# EAGLE design EPD_DRIVER (EAGLE 7.2.0)
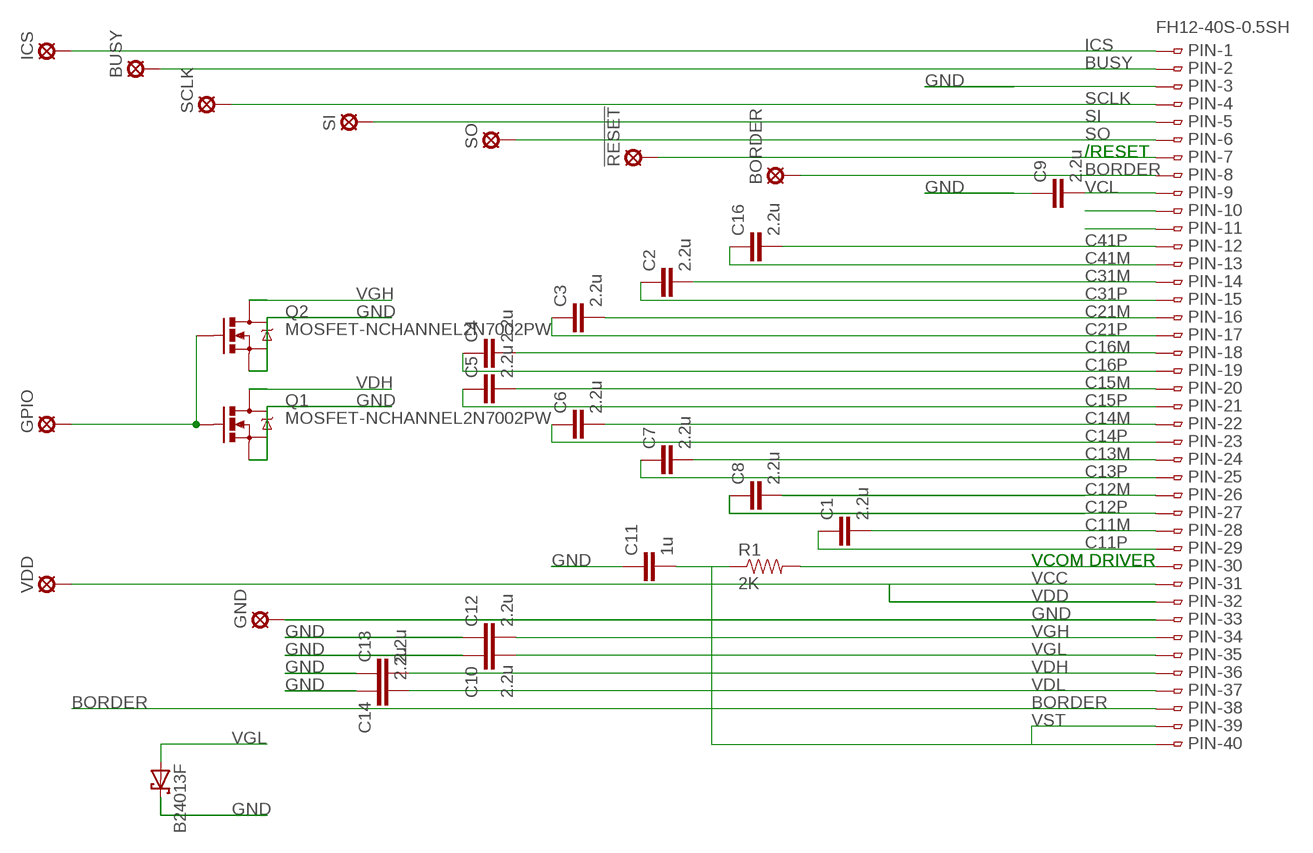
[diagram p0: schematic, sheet 1]

## Parts
!RESET  SE11  [SE11]
B24013F  SCHOTTKY-DIODESMD  [SMB]
BORDER  SE11  [SE11]
BUSY  SE11  [SE11]
C1  2.2u  CAP0603-CAP  [0603-CAP]
C2  2.2u  CAP0603-CAP  [0603-CAP]
C3  2.2u  CAP0603-CAP  [0603-CAP]
C4  2.2u  CAP0603-CAP  [0603-CAP]
C5  2.2u  CAP0603-CAP  [0603-CAP]
C6  2.2u  CAP0603-CAP  [0603-CAP]
C7  2.2u  CAP0603-CAP  [0603-CAP]
C8  2.2u  CAP0603-CAP  [0603-CAP]
C9  2.2u  CAP0603-CAP  [0603-CAP]
C10  2.2u  CAP0603-CAP  [0603-CAP]
C11  1u  CAP0603-CAP  [0603-CAP]
C12  2.2u  CAP0603-CAP  [0603-CAP]
C13  2.2u  CAP0603-CAP  [0603-CAP]
C14  2.2u  CAP0603-CAP  [0603-CAP]
C16  2.2u  CAP0603-CAP  [0603-CAP]
GND  SE11  [SE11]
GPIO  SE11  [SE11]
ICS  SE11  [SE11]
PIN  FH12-40S-0.5SH  [FH12-40S-0.5SH]
Q1  MOSFET-NCHANNEL2N7002PW  [SOT323]
Q2  MOSFET-NCHANNEL2N7002PW  [SOT323]
R1  2K  RESISTOR0603-RES  [0603-RES]
SCLK  SE11  [SE11]
SI  SE11  [SE11]
SO  SE11  [SE11]
VDD  SE11  [SE11]

## Nets
BORDER: BORDER.MP PIN.8 PIN.38
GND: B24013F.C C9.1 C10.1 C11.1 C12.1 C13.1 C14.1 PIN.3 Q1.2(S) Q2.2(S)
ICS: ICS.MP PIN.1
N$1: PIN.4 SCLK.MP
N$2: BUSY.MP PIN.2
N$4: PIN.5 SI.MP
N$5: PIN.6 SO.MP
N$6: !RESET.MP PIN.7
N$8: GND.MP PIN.33
N$9: PIN.10
N$10: PIN.11
N$11: C16.2 PIN.12
N$12: C16.1 PIN.13
N$13: C2.2 PIN.14
N$14: C2.1 PIN.15
N$15: C3.2 PIN.16
N$16: C3.1 PIN.17
N$17: C4.2 PIN.18
N$18: C4.1 PIN.19
N$19: C5.2 PIN.20
N$20: C5.1 PIN.21
N$21: C6.2 PIN.22
N$22: C6.1 PIN.23
N$23: C7.2 PIN.24
N$24: C7.1 PIN.25
N$25: C8.2 PIN.26
N$26: C8.1 PIN.27
N$27: C1.2 PIN.28
N$28: C1.1 PIN.29
N$29: PIN.30 R1.2
N$30: PIN.31 PIN.32 VDD.MP
N$41: GPIO.MP Q1.1(G) Q2.1(G)
VCL: C9.2 PIN.9
VDH: C13.2 PIN.36 Q1.3(D)
VDL: C14.2 PIN.37
VGH: C10.2 PIN.34 Q2.3(D)
VGL: B24013F.A C12.2 PIN.35
VST: C11.2 PIN.39 PIN.40 R1.1

## Notes on the sheet
- ICS
- BUSY
- SCLK
- SI
- SO
- /RESET | /RESET
- BORDER
- VCL
- C41P
- C41M
- C31M
- C31P
- C21M
- C21P
- C16M
- C16P
- C15M
- C15P
- C14M
- C14P
- C13M
- C13P
- C12M
- C12P
- C11M
- C11P
- VCOM DRIVER | VCOM DRIVER
- VCC
- VDD
- GND
- VGL
- VDH
- VDL
- BORDER
- VST
- VGL

## Library data of the parts
!RESET BORDER BUSY GND GPIO ICS SCLK SI SO VDD = solpad:SE11: SOLDER PAD RTM, drill 1,1mm, distributor Buerklin, 07F810
B24013F = diode:SCHOTTKY-DIODE: Schottky Diode
C1-C14 C16 = SparkFun-Capacitors:CAP: Capacitor Standard 0603 ceramic capacitor, and 0.1" leaded capacitor.
PIN = con-hirose:FH12-40S-0.5S: 0.5mm Pitch Connectors For FPC/FFC Source: Data sheet <http://www.hirose.co.jp/cataloge_hp/e58605370.pdf>; MPN: FH12-40S-0.5SH(55); OC_FARNELL: 1324556; OC_NEWARK: 34M6178
Q1 Q2 = SparkFun-DiscreteSemi:MOSFET-NCHANNEL: Common NMOSFET Parts MFG P/N Store ID Prod ID FDD8780 TRANS-09984 SI7820DN TRANS-11055 FDS6630A IC-08089 2N7002PW TRANS-11151 FQP30N06L COM-10213 TRANS-10060 BSS123LT1G TRANS-08345 BSS138 TRANS-00830 BS170 2N7000; PROD_ID: TRANS-11151
R1 = SparkFun-Passives:RESISTOR: Resistor Basic schematic elements and footprints for 0603, 1206, and PTH resistors.

## Board
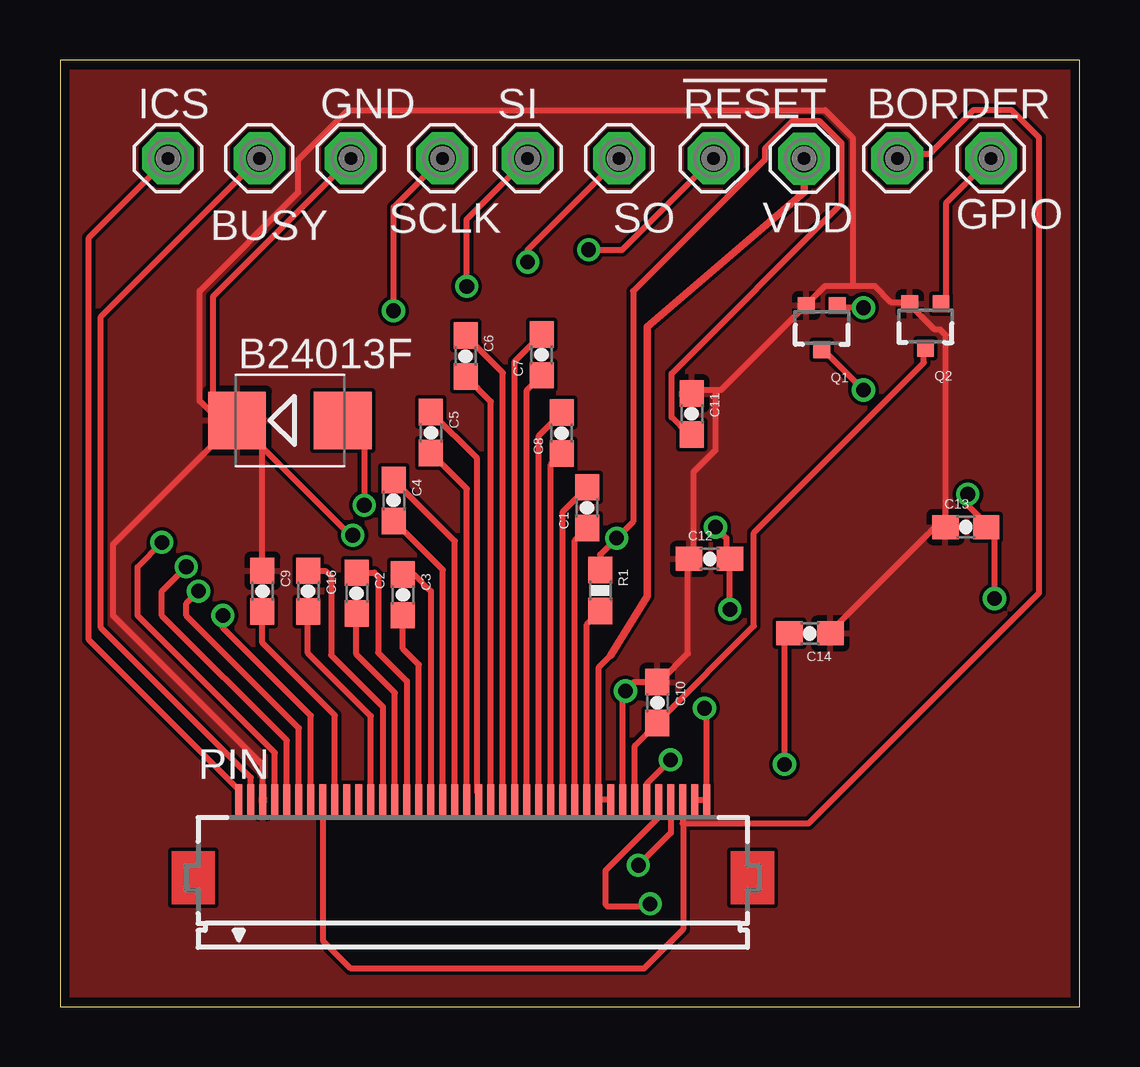
[diagram p1: board, top side]
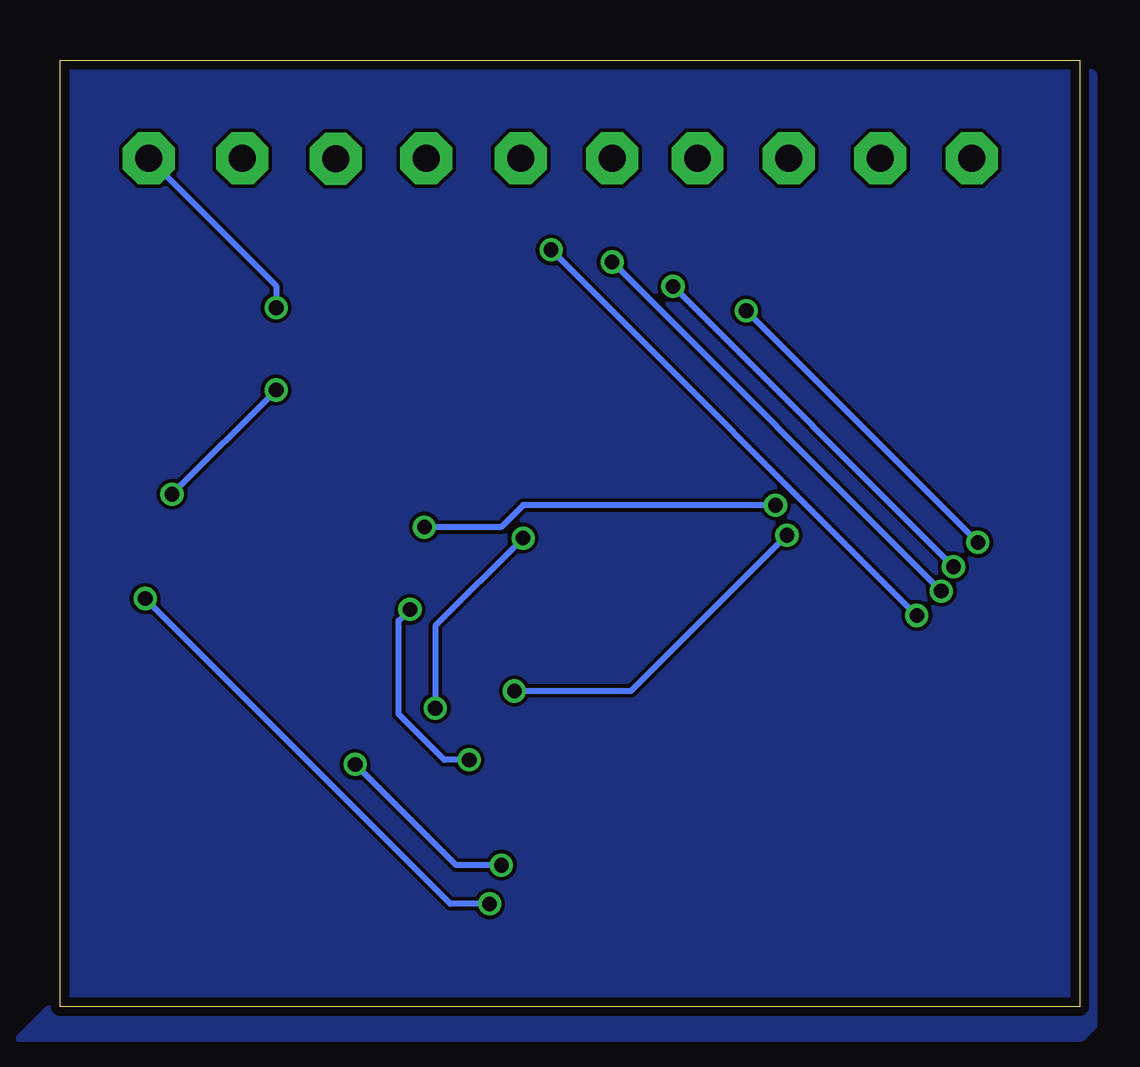
[diagram p2: board, bottom side, seen from below]

Size 42.49 x 39.44 mm. Coordinates in mm from the lower left corner, seen from the top.
Outline: 0,0 42.49,0 42.49,39.44 0,39.44 0,0
Copper layers (1*16): Top 0.0356mm / dielectric 1.5011mm / Bottom 0.0356mm
Design rules "oshpark-2layer": minimum track width 6mil, minimum drill 13mil, track to track 6mil, track to pad 6mil, pad to pad 6mil, via to via 6mil, smd to smd 6mil, copper to edge 15mil, drill to drill 6mil, minimum pad ring 7mil, minimum via ring 7mil, stop-mask expansion 4mil, vias tented up to drill 0mil, thermal gap 10mil

### Footprints (pad centres in the part's own frame; a part is rotated, then mirrored left to right if it is on the bottom)
SE11 = drill 1.118 pad 2.159 octagon: MP 0,0
SMB = smd 2.4 x 2.4: A 2.2,0; C -2.2,0
0603-CAP = smd 1.1 x 1: 1 -0.85,0; 2 0.85,0
FH12-40S-0.5SH = smd 0.3 x 1.3: 1 -9.75,3.25; 2 -9.25,3.25; 3 -8.75,3.25; 4 -8.25,3.25; 5 -7.75,3.25; 6 -7.25,3.25; 7 -6.75,3.25; 8 -6.25,3.25; 9 -5.75,3.25; 10 -5.25,3.25; 11 -4.75,3.25; 12 -4.25,3.25; 13 -3.75,3.25; 14 -3.25,3.25; 15 -2.75,3.25; 16 -2.25,3.25; 17 -1.75,3.25; 18 -1.25,3.25; 19 -0.75,3.25; 20 -0.25,3.25; 21 0.25,3.25; 22 0.75,3.25; 23 1.25,3.25; 24 1.75,3.25; 25 2.25,3.25; 26 2.75,3.25; 27 3.25,3.25; 28 3.75,3.25; 29 4.25,3.25; 30 4.75,3.25; 31 5.25,3.25; 32 5.75,3.25; 33 6.25,3.25; 34 6.75,3.25; 35 7.25,3.25; 36 7.75,3.25; 37 8.25,3.25; 38 8.75,3.25; 39 9.25,3.25; 40 9.75,3.25
SOT323 = smd 0.7 x 0.7: 1 -0.65,-0.925; 2 0.65,-0.925; 3 0,0.925
0603-RES = smd 1.1 x 1: 1 -0.85,0; 2 0.85,0

### Placement (x,y rotation side)
!RESET  27.23,35.34 0 top
B24013F  9.58,24.42 0 top
BORDER  34.89,35.34 0 top
BUSY  8.31,35.34 0 top
C1  21.96,20.79 90 top
C2  12.36,17.23 270 top
C3  14.29,17.16 270 top
C4  13.9,21.09 270 top
C5  15.45,23.92 270 top
C6  16.9,27.11 270 top
C7  20.06,27.15 90 top
C8  20.9,23.9 90 top
C9  8.44,17.31 270 top
C10  24.89,12.67 270 top
C11  26.32,24.69 270 top
C12  27.06,18.65 0 top
C13  37.74,19.98 0 top
C14  31.25,15.55 180 top
C16  10.34,17.31 270 top
GND  12.12,35.34 0 top
GPIO  38.79,35.34 0 top
ICS  4.5,35.34 0 top
PIN  17.2,5.37 0 top
Q1  31.74,28.29 180 top
Q2  36.06,28.36 180 top
R1  22.51,17.34 270 top
SCLK  15.93,35.34 0 top
SI  19.49,35.34 0 top
SO  23.3,35.34 0 top
VDD  31,35.33 0 top

### Tracks (layer width: path | path; a pad name or v marks a point on that pad's centre or on a via)
BORDER
  Top 0.254: 25.96,7.63 25.96,8.61 PIN.38 | 25.96,7.63 31.2,7.63 40.8,17.23 40.8,36.21 39.65,37.35 38.05,37.35 36.23,35.52 35.08,35.52 BORDER.MP | 25.94,7.63 25.96,7.63 | 25.96,7.63 25.96,3.21 24.34,1.59 24.33,1.6 12.1,1.6 10.95,2.75 PIN.8
GND
  Top 0.254: PIN.3 8.45,10.06 2.21,16.29 2.21,19.25 B24013F.C | C9.1 8.44,23.36 B24013F.C | 23.49,13.08 23.93,13.52 C10.1 25.02,13.57 26.17,14.72 26.17,18.6 C12.1 26.4,18.83 26.4,22.26 27.31,23.17 27.31,25.69 | 27.31,25.69 27.54,25.69 30.97,29.12 Q1.2 31.2,29.35 31.88,30.03 33.02,30.03 | 27.31,25.69 26.4,25.69 C11.1 | 33.02,30.03 33.94,30.03 34.62,29.35 35.31,29.35 Q2.2 35.54,29.12 36.45,28.2 36.68,28.2 36.91,27.98 36.91,20.2 C13.1 36.68,20.2 32.11,15.63 C14.1 | 33.02,30.03 33.02,36.21 31.88,37.35 11.99,37.35 9.94,35.29 9.94,33.92 5.82,29.8 5.82,25.23 6.96,24.09 B24013F.C
  pour Top: 41.11,40.06 43.57,37.6 43.57,0.29 42.14,-1.14 0.21,-1.14 -0.74,-0.19 -0.74,39.48 -0.16,40.05 -0.15,40.06
  pour Bottom: -0.17,39.28 41.68,39.28 42.88,38.08 42.88,0.03 44.25,-1.34 -0.08,-1.34 -0.63,-0.79 -0.63,38.82 -0.26,39.19
ICS
  Top 0.254: PIN.1 7.45,9.02 1.2,15.28 1.2,32.04 ICS.MP
N$1  (via drill 0.61)
  Top 0.254: PIN.4 8.95,10.57 3.23,16.29 3.23,18.32 v4.25,19.34 | v13.9,28.99 13.9,33.31 SCLK.MP
  Bottom 0.254: v4.25,19.34 v13.9,28.99
N$2
  Top 0.254: PIN.2 7.95,9.54 1.71,15.78 1.71,28.74 BUSY.MP
N$4  (via drill 0.61)
  Top 0.254: PIN.5 9.45,11.09 4.25,16.29 4.25,17.31 v5.26,18.32 | v16.95,30.01 16.95,32.8 SI.MP
  Bottom 0.254: v5.26,18.32 v16.95,30.01
N$5  (via drill 0.61)
  Top 0.254: PIN.6 9.95,11.6 5.26,16.29 5.26,16.8 v5.77,17.31 | v19.49,31.02 19.49,31.53 SO.MP
  Bottom 0.254: v5.77,17.31 v19.49,31.02
N$6  (via drill 0.61)
  Top 0.254: PIN.7 10.45,12.12 6.79,15.78 v6.79,16.29 | v22.03,31.53 23.42,31.53 !RESET.MP
  Bottom 0.254: v6.79,16.29 v22.03,31.53
N$8  (via drill 0.61)
  Top 0.254: GND.MP 6.37,29.58 6.37,25.37 12.1,19.64 v12.2,19.64 | PIN.33 23.45,13.04 v23.56,13.15
  Bottom 0.254: v23.56,13.15 18.69,13.15 v12.2,19.64
N$11
  Top 0.254: PIN.12 12.95,12.1 10.33,14.72 10.33,16.45 C16.2
N$12
  Top 0.254: C16.1 11.06,18.16 11.3,17.92 11.3,14.64 13.45,12.49 PIN.13
N$13
  Top 0.254: PIN.14 13.95,13.07 12.35,14.67 12.35,16.37 C2.2
N$14
  Top 0.254: C2.1 13.09,18.08 13.26,17.91 13.26,14.75 14.45,13.56 PIN.15
N$15
  Top 0.254: PIN.16 14.95,14.25 14.29,14.91 C3.2
N$16
  Top 0.254: C3.1 14.75,18.01 15.45,17.31 PIN.17
N$17
  Top 0.254: PIN.18 15.95,18.19 C4.2
N$18
  Top 0.254: PIN.19 16.45,19.39 C4.1
N$19
  Top 0.254: PIN.20 16.95,21.57 C5.2
N$20
  Top 0.254: PIN.21 17.45,8.87 17.38,8.94 17.38,22.84 C5.1
N$21
  Top 0.254: PIN.22 17.95,25.2 C6.2
N$22
  Top 0.254: PIN.23 18.45,26.41 C6.1
N$23
  Top 0.254: PIN.24 18.95,26.89 C7.2
N$24
  Top 0.254: PIN.25 19.45,25.69 C7.1
N$25
  Top 0.254: PIN.26 19.95,23.79 C8.2
N$26
  Top 0.254: PIN.27 20.45,22.59 C8.1
N$27
  Top 0.254: PIN.28 20.95,20.63 C1.2
N$28
  Top 0.254: PIN.29 21.45,19.43 C1.1
N$29
  Top 0.254: PIN.30 21.95,15.93 R1.2
N$30
  Top 0.254: PIN.32 PIN.31 22.45,14.14 22.94,14.63
  Top 0.305: VDD.MP 31,33.92 24.46,28.33 24.46,17.1 22.94,14.63
N$41  (via drill 0.61)
  Top 0.254: v33.48,29.12 32.57,29.12 Q1.1 | GPIO.MP 36.91,33.46 36.91,29.35 Q2.1
  Bottom 0.254: v33.48,29.12 33.48,30.03 GPIO.MP
VCL
  Top 0.254: PIN.9 11.45,12.14 8.44,15.15 C9.2
VDH  (via drill 0.61)
  Top 0.254: v33.48,25.69 31.88,27.29 Q1.3 | v37.83,21.35 37.83,20.89 38.51,20.2 C13.2 38.94,19.63 v38.94,17 | PIN.36 24.95,7.89 22.72,5.66 22.72,4.27 22.82,4.17 24.48,4.17 v24.59,4.28
  Bottom 0.254: v37.83,21.35 v33.48,25.69 | v24.59,4.28 26.22,4.28 v38.94,17
VDL  (via drill 0.61)
  Top 0.254: PIN.37 25.45,7.24 v24.1,5.89 | v30.19,10.09 30.19,15.35 C14.2
  Bottom 0.254: v24.1,5.89 25.99,5.89 v30.19,10.09
VGH
  Top 0.254: PIN.34 23.95,10.88 C10.2 25.02,11.97 28.91,15.86 28.91,19.75 36,26.83 36,27.29 Q2.3
VGL  (via drill 0.61)
  Top 0.254: v27.31,19.98 27.77,19.52 27.77,18.83 C12.2 v27.91,16.55 | v12.68,20.89 12.68,23.63 11.99,24.32 B24013F.A | PIN.35 24.45,9.29 v25.44,10.28
  Bottom 0.254: v27.31,19.98 24.11,19.98 23.19,20.89 v12.68,20.89 | v25.44,10.28 26.47,10.28 28.38,12.19 28.38,16.08 v27.91,16.55
VST  (via drill 0.61)
  Top 0.254: R1.1 22.51,18.38 22.51,18.83 v23.19,19.52 23.88,20.2 23.88,29.8 29.37,35.29 29.37,35.75 30.51,36.89 31.65,36.89 32.57,35.98 32.57,33.46 25.48,26.38 25.48,24.55 26.17,23.86 C11.2 | PIN.39 PIN.40 26.95,12.33 v26.85,12.43
  Bottom 0.254: v26.85,12.43 26.85,15.86 v23.19,19.52